# EAGLE design RedBoard-Artemis-Nano (EAGLE 9.4.2)

## Sheet 1 of 2
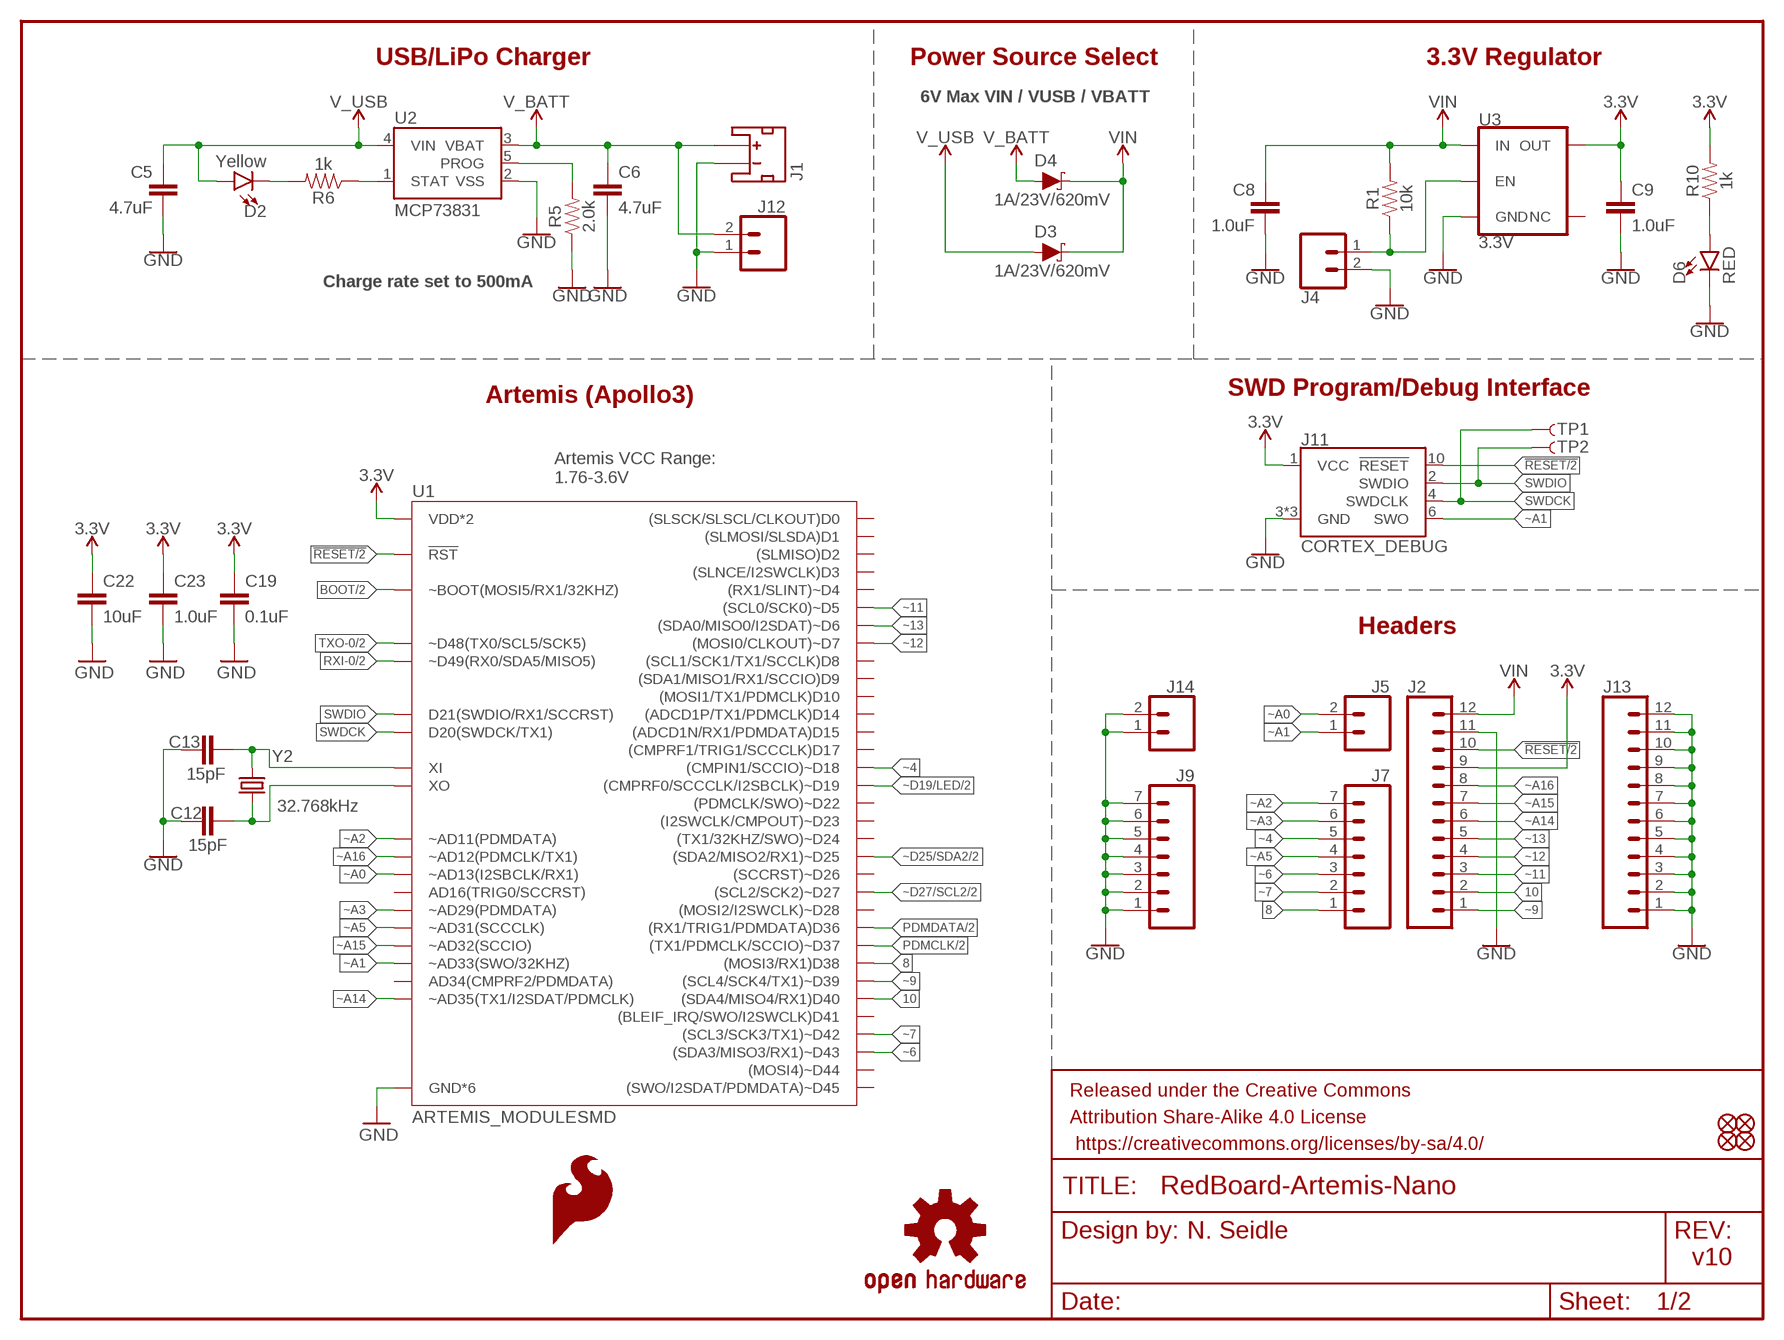
[diagram p0: schematic, sheet 1]

### Parts
C5  4.7uF  4.7UF-0603-6.3V-(10%)  [0603]
C6  4.7uF  4.7UF-0603-6.3V-(10%)  [0603]
C8  1.0uF  1.0UF-0402T-16V-10%  [0402-TIGHT]
C9  1.0uF  1.0UF-0402T-16V-10%  [0402-TIGHT]
C12  15pF  15PF-0603-50V-5%  [0603]
C13  15pF  15PF-0603-50V-5%  [0603]
C19  0.1uF  0.1UF-0402T-16V-10%  [0402-TIGHT]
C22  10uF  10UF-0603-6.3V-20%  [0603]
C23  1.0uF  1.0UF-0402T-16V-10%  [0402-TIGHT]
D2  Yellow  LED-YELLOW0603  [LED-0603]
D3  1A/23V/620mV  DIODE-SCHOTTKY-BAT20J  [SOD-323]
D4  1A/23V/620mV  DIODE-SCHOTTKY-BAT20J  [SOD-323]
D6  RED  LED-RED0603  [LED-0603]
FD1  FIDUCIALUFIDUCIAL  [FIDUCIAL-MICRO]
FD2  FIDUCIALUFIDUCIAL  [FIDUCIAL-MICRO]
FD3  FIDUCIALUFIDUCIAL  [FIDUCIAL-MICRO]
FD4  FIDUCIALUFIDUCIAL  [FIDUCIAL-MICRO]
FRAME1  FRAME-LETTER  [CREATIVE_COMMONS]
J1  JST_2MM_MALE  [JST-2-SMD]
J2  CONN_12NO_SILK  [1X12_NO_SILK]
J4  CONN_021X02_NO_SILK  [1X02_NO_SILK]
J5  CONN_021X02_NO_SILK  [1X02_NO_SILK]
J7  CONN_07NO_SILK  [1X07_NO_SILK]
J9  CONN_07NO_SILK  [1X07_NO_SILK]
J11  CORTEX_DEBUG  CORTEX_JTAG_DEBUG_MINIMUM_PTH_NS  [2X5-PTH-1.27MM-NO_SILK]
J12  CONN_021X02_NO_SILK  [1X02_NO_SILK]
J13  CONN_12NO_SILK  [1X12_NO_SILK]
J14  CONN_021X02_NO_SILK  [1X02_NO_SILK]
LOGO1  SFE_LOGO_FLAME.1_INCH  [SFE_LOGO_FLAME_.1]
LOGO2  OSHW-LOGONO_SILK  [DUMMY]
LOGO4  SFE_LOGO_FLAME.1_INCH  [SFE_LOGO_FLAME_.1]
R1  10k  10KOHM-0603-1/10W-1%  [0603]
R5  2.0k  2.0KOHM-0603-1/10W-5%  [0603]
R6  1k  1KOHM-0603-1/10W-1%  [0603]
R10  1k  1KOHM-0603-1/10W-1%  [0603]
TP1  TEST-POINT3X5  [PAD.03X.05]
TP2  TEST-POINT3X5  [PAD.03X.05]
U1  ARTEMIS_MODULESMD  [ARTEMIS_FP]
U2  MCP73831  [SOT23-5]
U3  3.3V  V_REG_AP2112K-3.3V  [SOT23-5]
Y2  32.768kHz  CRYSTAL-32.768KHZSMD-3.2X1.5  [CRYSTAL-SMD-3.2X1.5MM]

### Nets
3.3V: C9.1 C19.2 C22.1 C23.1 J2.9 J11.1(VCC) R10.2 U1.VDD@36(VDD*2) U1.VDD@37(VDD*2) U3.5(OUT) ; also sheet 2
8: J7.1 U1.D38((MOSI3/RX1)D38)
10: J2.2 U1.D40((SDA4/MISO4/RX1)D40)
!RESET: J2.10 J11.10(!RESET) U1.~RST(!RST) ; also sheet 2
BOOT: U1.BOOT(~BOOT(MOSI5/RX1/32KHZ)) ; also sheet 2
GND: C5.2 C6.2 C8.2 C9.2 C12.1 C13.1 C19.1 C22.2 C23.2 D6.C J1.1(-) J2.11 J4.2 J9.1 J9.2 J9.3 J9.4 J9.5 J9.6 J9.7 J11.3(GND) J11.5(GND) J11.9(GND) J12.1 J13.1 J13.2 J13.3 J13.4 J13.5 J13.6 J13.7 J13.8 J13.9 J13.10 J13.11 J13.12 J14.1 J14.2 R5.1 U1.GND@1(GND*6) U1.GND@22(GND*6) U1.GND@38(GND*6) U1.GND@39(GND*6) U1.GND@47(GND*6) U1.GND@59(GND*6) U2.2(VSS) U3.2(GND) ; also sheet 2
N$1: R5.2 U2.5(PROG)
N$2: C12.2 U1.XO Y2.P$2
N$3: D2.C R6.2
N$4: R6.1 U2.1(STAT)
N$8: C13.2 U1.XI Y2.P$1
N$10: D6.A R10.1
PDMCLK: U1.~D37((TX1/PDMCLK/SCCIO)~D37) ; also sheet 2
PDMDATA: U1.D36((RX1/TRIG1/PDMDATA)D36) ; also sheet 2
RXI-0: U1.RXI-0(~D49(RX0/SDA5/MISO5)) ; also sheet 2
SWDCK: J11.4(SWDCLK) TP1.P$1 U1.SWDCK(D20(SWDCK/TX1))
SWDIO: J11.2(SWDIO) TP2.P$1 U1.SWDIO(D21(SWDIO/RX1/SCCRST))
TXO-0: U1.TXO-0(~D48(TX0/SCL5/SCK5)) ; also sheet 2
V_BATT [power]: C6.1 D4.A J1.2(+) J12.2 U2.3(VBAT)
V_USB: C5.1 D2.A D3.A U2.4(VIN) ; also sheet 2
VIN: C8.1 D3.C D4.C J2.12 R1.2 U3.1(IN)
VREG_EN: J4.1 R1.1 U3.3(EN)
~4: J7.5 U1.~D18((CMPIN1/SCCIO)~D18)
~6: J7.3 U1.~D43((SDA3/MISO3/RX1)~D43)
~7: J7.2 U1.~D42((SCL3/SCK3/TX1)~D42)
~9: J2.1 U1.~D39((SCL4/SCK4/TX1)~D39)
~11: J2.3 U1.~D5((SCL0/SCK0)~D5)
~12: J2.4 U1.D7((MOSI0/CLKOUT)~D7)
~13: J2.5 U1.~D6((SDA0/MISO0/I2SDAT)~D6)
~A0: J5.2 U1.~AD13(~AD13(I2SBCLK/RX1))
~A1: J5.1 J11.6(SWO) U1.~AD33/SWO(~AD33(SWO/32KHZ))
~A2: J7.7 U1.~AD11(~AD11(PDMDATA))
~A3: J7.6 U1.~AD29(~AD29(PDMDATA))
~A5: J7.4 U1.~AD31(~AD31(SCCCLK))
~A14: J2.6 U1.~AD35(~AD35(TX1/I2SDAT/PDMCLK))
~A15: J2.7 U1.~AD32(~AD32(SCCIO))
~A16: J2.8 U1.~AD12(~AD12(PDMCLK/TX1))
~D19/LED: U1.~D19((CMPRF0/SCCCLK/I2SBCLK)~D19) ; also sheet 2
~D25/SDA2: U1.~D25((SDA2/MISO2/RX1)~D25) ; also sheet 2
~D27/SCL2: U1.~D27((SCL2/SCK2)~D27) ; also sheet 2
Unconnected: J1.NC1(PAD1) J1.NC2(PAD2) U1.AD16(AD16(TRIG0/SCCRST)) U1.AD34(AD34(CMPRF2/PDMDATA)) U1.D0((SLSCK/SLSCL/CLKOUT)D0) U1.D1((SLMOSI/SLSDA)D1) U1.D2((SLMISO)D2) U1.D3((SLNCE/I2SWCLK)D3) U1.D8((SCL1/SCK1/TX1/SCCLK)D8) U1.D9((SDA1/MISO1/RX1/SCCIO)D9) U1.D10((MOSI1/TX1/PDMCLK)D10) U1.D14((ADCD1P/TX1/PDMCLK)D14) U1.D15((ADCD1N/RX1/PDMDATA)D15) U1.D17((CMPRF1/TRIG1/SCCCLK)D17) U1.D41((BLEIF_IRQ/SWO/I2SWCLK)D41) U1.~D4((RX1/SLINT)~D4) U1.~D22((PDMCLK/SWO)~D22) U1.~D23((I2SWCLK/CMPOUT)~D23) U1.~D24((TX1/32KHZ/SWO)~D24) U1.~D26((SCCRST)~D26) U1.~D28((MOSI2/I2SWCLK)~D28) U1.~D44((MOSI4)~D44) U1.~D45((SWO/I2SDAT/PDMDATA)~D45) U3.4(NC)

### Notes on the sheet
- USB/LiPo Charger | Power Source Select | 3.3V Regulator
- 6V Max VIN / VUSB / VBATT
- Charge rate set to 500mA
- Artemis (Apollo3) | SWD Program/Debug Interface
- Artemis VCC Range:
  1.76-3.6V
- Headers
- N. Seidle
- v10

## Sheet 2 of 2
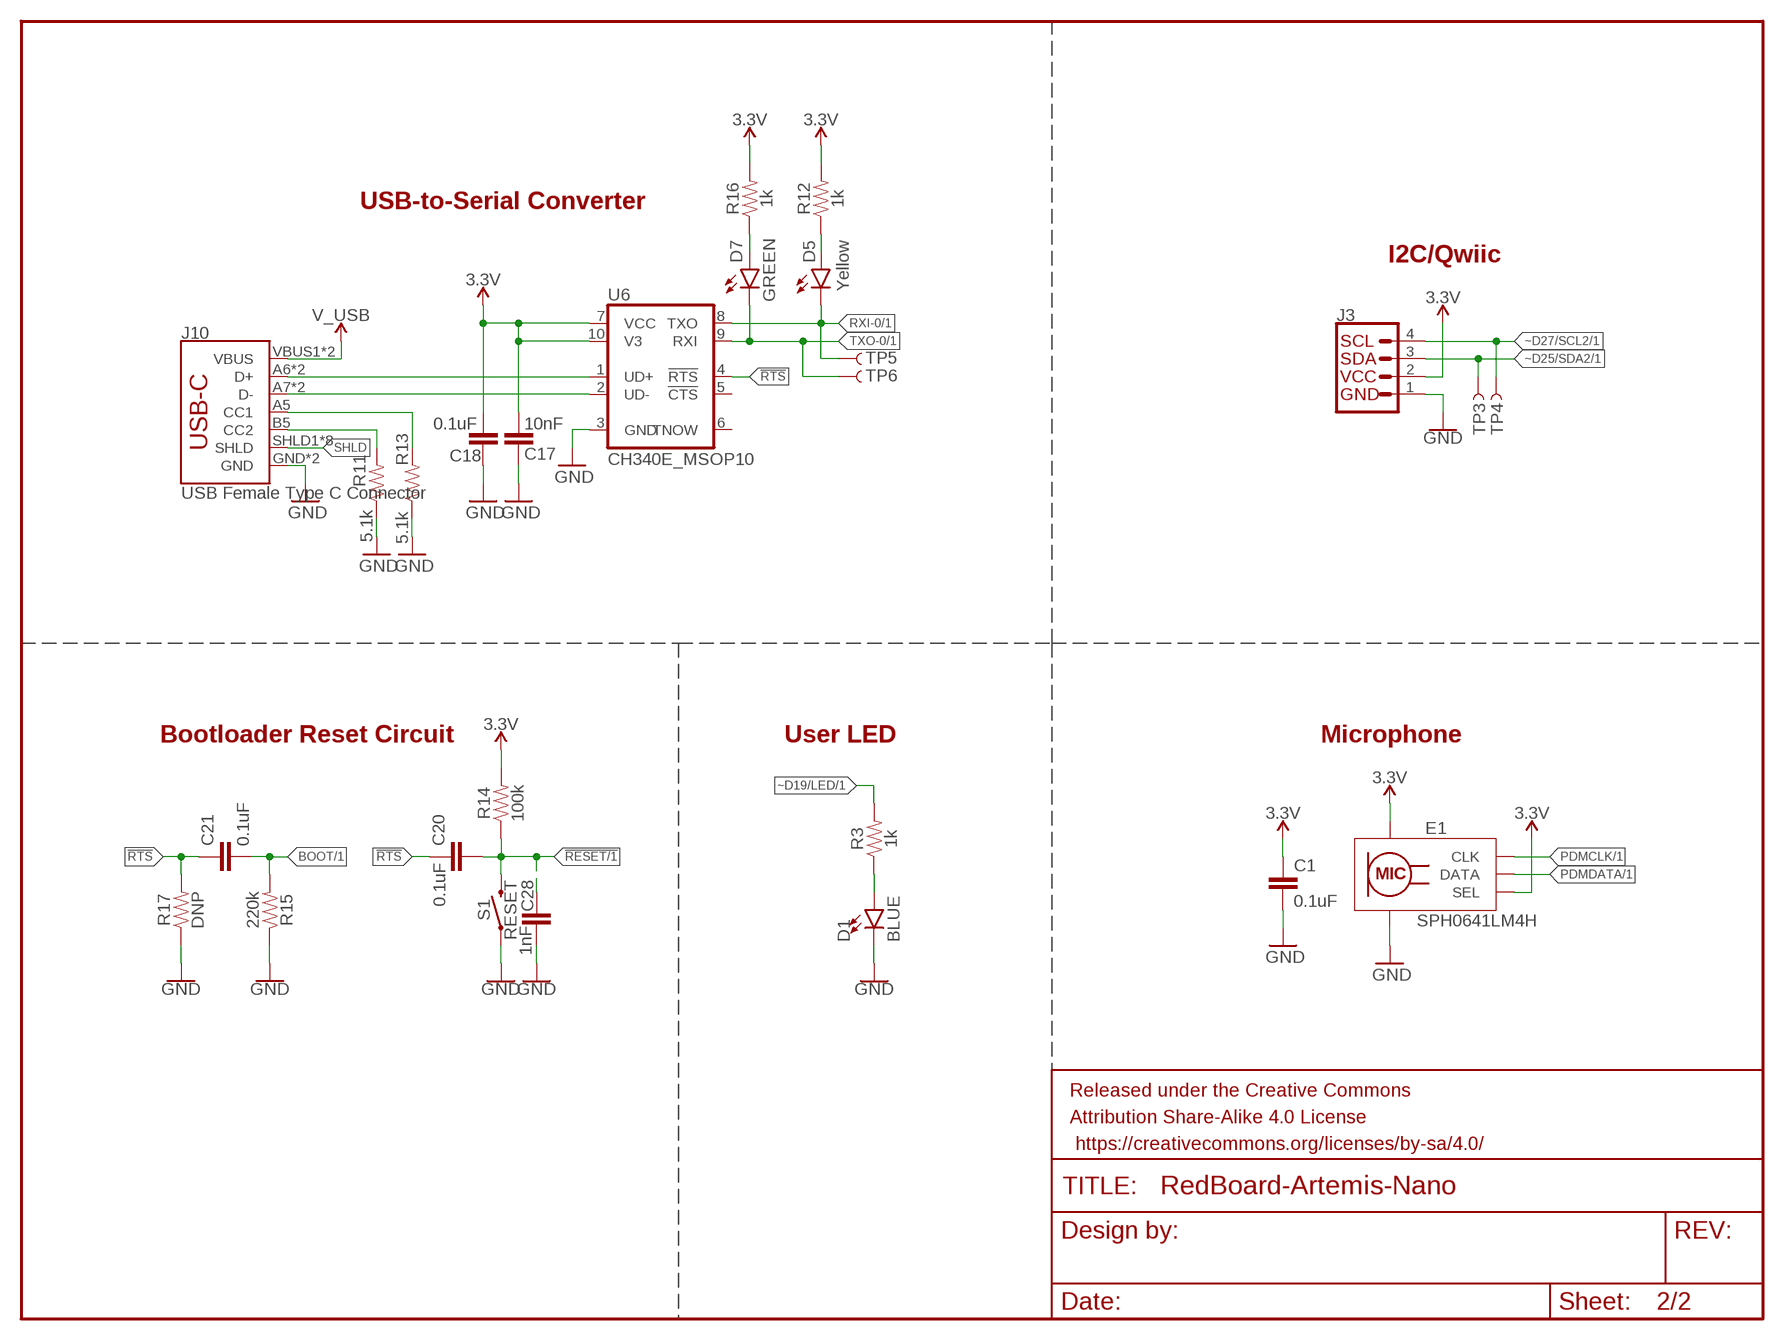
[diagram p1: schematic, sheet 2]

### Parts
C1  0.1uF  0.1UF-0402T-16V-10%  [0402-TIGHT]
C17  10nF  10NF-0603-50V-10%  [0603]
C18  0.1uF  0.1UF-0603-25V-(+80/-20%)  [0603]
C20  0.1uF  0.1UF-0603-25V-5%  [0603]
C21  0.1uF  0.1UF-0603-25V-5%  [0603]
C28  1nF  1.0NF/1000PF-0603-50V-10%  [0603]
D1  BLUE  LED-BLUE0603  [LED-0603]
D5  Yellow  LED-YELLOW0603  [LED-0603]
D7  GREEN  LED-GREEN0603  [LED-0603]
E1  SPH0641LM4H  SPH0641LM4H-1_MICROPHONE  [SPH0641LM4H-1_MICROPHONE]
FRAME2  FRAME-LETTERNO_PACKAGE  [DUMMY]
J3  QWIIC_CONNECTORJS-1MM  [JST04_1MM_RA]
J10  USB Female Type C Connector  USB_C4-LAYER-ISOLATED  [USB-C-16P-4LAYER-ISOLATED]
R3  1k  1KOHM-0603-1/10W-1%  [0603]
R11  5.1k  5.1KOHM5.1KOHM-0603-1/10W-1%  [0603]
R12  1k  1KOHM-0603-1/10W-1%  [0603]
R13  5.1k  5.1KOHM5.1KOHM-0603-1/10W-1%  [0603]
R14  100k  100KOHM-0603-1/10W-1%  [0603]
R15  220k  220KOHM-0603-1/10W-1%  [0603]
R16  1k  1KOHM-0603-1/10W-1%  [0603]
R17  DNP  RESISTOR0603  [0603]
S1  RESET  MOMENTARY-SWITCH-SPST-SMD-4.6X2.8MM  [TACTILE_SWITCH_SMD_4.6X2.8MM]
TP3  TEST-POINT3X5  [PAD.03X.05]
TP4  TEST-POINT3X5  [PAD.03X.05]
TP5  TEST-POINT3X5  [PAD.03X.05]
TP6  TEST-POINT3X5  [PAD.03X.05]
U6  CH340E_MSOP10  [MSOP10]

### Nets
3.3V: C1.1 C17.1 C18.1 E1.2(SEL) E1.5(VDD) J3.2 R12.2 R14.2 R16.2 U6.7(VCC) U6.10(V3) ; also sheet 1
!RESET: C20.2 C28.1 R14.1 S1.3 S1.4 ; also sheet 1
!RTS: C20.1 C21.1 R17.2 U6.4(!RTS)
BOOT: C21.2 R15.2 ; also sheet 1
CC1: J10.A5(CC1) R13.2
CC2: J10.B5(CC2) R11.2
D+1: J10.A6(D+) J10.B6(D+) U6.1(UD+)
D-1: J10.A7(D-) J10.B7(D-) U6.2(UD-)
GND: C1.2 C17.2 C18.2 C28.2 D1.C E1.3(GND) E1.6(GND) E1.7(GND) E1.8(GND) J3.1 J10.GND J10.GND2(GND) R11.1 R13.1 R15.1 R17.1 S1.1 S1.2 U6.3(GND) ; also sheet 1
N$5: D7.A R16.1
N$7: D1.A R3.1
N$9: D5.A R12.1
PDMCLK: E1.4(CLK) ; also sheet 1
PDMDATA: E1.1(DATA) ; also sheet 1
RXI-0: D5.C TP5.P$1 U6.8(TXO) ; also sheet 1
SHLD: J10.SHLD1(SHLD) J10.SHLD2(SHLD) J10.SHLD3(SHLD) J10.SHLD4(SHLD) J10.SHLD5(SHLD) J10.SHLD6(SHLD) J10.SHLD7(SHLD) J10.SHLD8(SHLD)
TXO-0: D7.C TP6.P$1 U6.9(RXI) ; also sheet 1
V_USB: J10.VBUS1(VBUS) J10.VBUS2(VBUS) ; also sheet 1
~D19/LED: R3.2 ; also sheet 1
~D25/SDA2: J3.3 TP3.P$1 ; also sheet 1
~D27/SCL2: J3.4 TP4.P$1 ; also sheet 1
Unconnected: U6.5(!CTS) U6.6(TNOW)

### Notes on the sheet
- USB-to-Serial Converter
- I2C/Qwiic
- Bootloader Reset Circuit | User LED | Microphone

## Library data of the parts
C1 C19 = SparkFun-Capacitors:0.1UF: 0.1µF ceramic capacitors A capacitor is a passive two-terminal electrical component used to store electrical energy temporarily in an electric field.; PROD_ID: CAP-12416
C5 C6 = SparkFun-Capacitors:4.7UF: 4.7µF ceramic capacitors A capacitor is a passive two-terminal electrical component used to store electrical energy temporarily in an electric field.; PROD_ID: CAP-08280
C8 C9 C23 = SparkFun-Capacitors:1.0UF: 1µF ceramic capacitors A capacitor is a passive two-terminal electrical component used to store electrical energy temporarily in an electric field.; PROD_ID: CAP-12417
C12 C13 = SparkFun-Capacitors:15PF: 15pF ceramic capacitors A capacitor is a passive two-terminal electrical component used to store electrical energy temporarily in an electric field.; PROD_ID: CAP-07881
C17 = SparkFun-Capacitors:10NF: 0.01uF/10nF/10,000pF ceramic capacitors A capacitor is a passive two-terminal electrical component used to store electrical energy temporarily in an electric field. CAP-09321; PROD_ID: CAP-00867
C18 = SparkFun-Capacitors:0.1UF: 0.1µF ceramic capacitors A capacitor is a passive two-terminal electrical component used to store electrical energy temporarily in an electric field.; PROD_ID: CAP-00810
C20 C21 = SparkFun-Capacitors:0.1UF: 0.1µF ceramic capacitors A capacitor is a passive two-terminal electrical component used to store electrical energy temporarily in an electric field.; PROD_ID: CAP-08604
C22 = SparkFun-Capacitors:10UF: 10.0µF ceramic capacitors A capacitor is a passive two-terminal electrical component used to store electrical energy temporarily in an electric field.; PROD_ID: CAP-11015
C28 = SparkFun-Capacitors:1.0NF/1000PF: 1nF/1,000pF ceramic capacitors A capacitor is a passive two-terminal electrical component used to store electrical energy temporarily in an electric field.; PROD_ID: CAP-07886
D1 = SparkFun-LED:LED-BLUE: Blue SMD LED Used in manufacturing of various products at SparkFun Packages: 0603 - SMD 0603 package [Product Link] <http://www.digikey.com/product-detail/en/SMLE12BC7TT86/511-1589-2-ND/1641808> 1206 - SMD1206 package [Product Link] <http://www.digikey.com/product-detail/en/lite-on-inc/LTST-C150TBKT/160-1643-1-ND/573584> SparkFun Products: ESP8266 Thing-Dev Board <https://www.sparkfun.com/products/13711> RedBoard <https://www.sparkfun.com/products/12757>; PROD_ID: DIO-08575
D2 D5 = SparkFun-LED:LED-YELLOW: Yellow SMD LED Used in manufacturing several products at SparkFun. Packages: 0603 - SMD 0603 package[Product Link] <http://www.kingbrightusa.com/product.asp?catalog_name=LED&product_id=APT1608SYCK> 0603 -SMART - SMART SMD 0603 package (more efficient/more expensive) [Product Link] <http://www.osram-os.com/osram_os/en/products/product-catalog/led-light-emitting-diodes/smartled-0603/ly-l29k/index.jsp> LilyPad - SMD1206 package[Product Datasheet] <https://www.sparkfun.com/datasheets/DevTools/LilyPad/Q150YUS4.pdf> SparkFun Products: Blynk Board <https://www.sparkfun.com/products/13794> IOIO-OTG <https://www.sparkfun.com/products/13613> XBee Explorer Serial <https://www.sparkfun.com/products/13225>; PROD_ID: DIO-09003
D3 D4 = SparkFun-DiscreteSemi:DIODE-SCHOTTKY: Schottky diode A Schottky diode is a semiconductor diode which has a low forward voltage drop and a very fast switching action.; PROD_ID: DIO-11623
D6 = SparkFun-LED:LED-RED: Red SMD LED Used in manufacturing of most products at SparkFun Packages: 0603 - SMD 0603 package [Product Link] <http://docs.avagotech.com/docs/AV02-0551EN> 0603 SMART - SMD 0603 SMART package ( more efficient and expensive)[Product Link] <http://www.osram-os.com/Graphics/XPic2/00077099_0.pdf> 1206 - SMD1206 package [Product Link] <https://www.sparkfun.com/datasheets/DevTools/LilyPad/Q150OVS4.pdff> SparkFun Products: Pro Mini 328 -5V <https://www.sparkfun.com/products/821> RedBoard <https://www.sparkfun.com/products/12757> IOIO-OTG <https://www.sparkfun.com/products/13613>; PROD_ID: DIO-00819
D7 = SparkFun-LED:LED-GREEN: Green SMD LED Used in manufacturing of various products at SparkFun Packages: 0603 - SMD 0603 package [Product Link] <http://www.futureelectronics.com/en/technologies/semiconductors/optoelectronics/leds/Pages/9894312-LTST-C190GKT.aspx?CrossPart=HSMG-C190&IM=0> LilyPad 1206 - SMD1206 LilyPad package [Product Link] <http://www.futureelectronics.com/en/Technologies/Product.aspx?ProductID=IN150NGHARVATEKCORPORATION2049943&IM=0> 1206 - SMD1206 package [Product Link] <http://www.futureelectronics.com/en/technologies/semiconductors/optoelectronics/leds/Pages/8315665-LTST-C150KGKT.aspx?IM=0> 1206 Bottom Mount -SMD 1206 Bottom Mount [Product Link] <http://www.digikey.com/product-detail/en/lite-on-inc/LTST-C230KGKT/160-1456-1-ND/386854> SparkFun Products: Pro Mini 328 -5V <https://www.sparkfun.com/products/821> RedBoard <https://www.sparkfun.com/products/12757> MP3 Trigger <https://www.sparkfun.com/products/13720> Makey Makey <https://www.sparkfun.com/products/11076>; PROD_ID: DIO-00821
E1 = SparkFun-Sensors:SPH0641LM4H-1_MICROPHONE: SPH0641LM4H-1 Microphone A miniature, high-performance, low power, bottom port silicon digital microphone with a single bit PDM output.; PROD_ID: IC-14361; VALUE: SPH0641LM4H-1
FD1-FD4 = SparkFun-Aesthetics:FIDUCIAL: Fiducial Alignment Points Point-of-reference for pick-and-place machines and other optical instruments.
FRAME1 = SparkFun-Aesthetics:FRAME-LETTER: Schematic Frame - Letter Standard 8.5x11 US Letter frame
FRAME2 = SparkFun-Aesthetics:FRAME-LETTER: Schematic Frame - Letter Standard 8.5x11 US Letter frame; DESIGNER: Nobody; VERSION: v01
J1 = SparkFun-Connectors:JST_2MM_MALE: JST 2MM MALE RA CONNECTOR Two pin, compact surface mount connector. Commonly used as a battery input connection point. We really like the solid locking feeling and high current rating on these small connectors. We use these all the time as battery connectors. Mates to single-cell LiPo batteries. Here is the connector we sell at SparkFun: JST Right Angle Connector - White <https://www.sparkfun.com/products/8612> (PRT-08612) Datasheet <http://www.sparkfun.com/datasheets/Prototyping/Connectors/JST-Horizontal.pdf> It was used on these SparkFun products: SparkFun MOSFET Power Controller <https://www.sparkfun.com/products/11214> (PRT-11214) SparkFun Battery Babysitter - LiPo Battery Manager <https://www.sparkfun.com/products/13777> (PRT-13777) And many, many others that required a lipo battery connection.; PROD_ID: CONN-11443; SF_ID: PRT-08612
J2 J13 = SparkFun-Connectors:CONN_12: Multi connection point. Often used as Generic Header-pin footprint for 0.1 inch spaced/style header connections On any of the 0.1 inch spaced packages, you can populate with these: Break Away Headers - Straight <https://www.sparkfun.com/products/116> (PRT-00116) Break Away Male Headers - Right Angle <https://www.sparkfun.com/products/553> (PRT-00553) Female Headers <https://www.sparkfun.com/products/115> (PRT-00115) Break Away Headers - Machine Pin <https://www.sparkfun.com/products/117> (PRT-00117) Break Away Female Headers - Swiss Machine Pin <https://www.sparkfun.com/products/743> (PRT-00743) For SCREWTERMINALS and SPRING TERMINALS visit here: Screw Terimnals on SparkFun.com <https://www.sparkfun.com/search/results?term=Screw+Terminals> (5mm/3.5mm/2.54mm spacing) This device is also useful as a general connection point to wire up your design to another part of your project. Our various solder wires solder well into these plated through hole pads. Hook-Up Wire - Assortment (Stranded, 22 AWG) <https://www.sparkfun.com/products/11375> (PRT-11375) Hook-Up Wire - Assortment (Solid Core, 22 AWG) <https://www.sparkfun.com/products/11367> (PRT-11367) View the entire wire category on our website here <https://www.sparkfun.com/categories/141> Special notes: Molex polarized connector foot print use with SKU : PRT-08231 with associated crimp pins and housings. 1MM SMD Version SKU: PRT-10208 NOTES ON THE VARIANTS LOCK and LOCK_LONGPADS... This footprint was designed to help hold the alignment of a through-hole component (i.e. 6-pin header) while soldering it into place. You may notice that each hole has been shifted either up or down by 0.005 of an inch from it's more standard position (which is a perfectly straight line). This slight alteration caused the pins (the squares in the middle) to touch the edges of the holes. Because they are alternating, it causes a "brace" to hold the component in place. 0.005 has proven to be the perfect amount of "off-center" position when using our standard breakaway headers. Although looks a little odd when you look at the bare footprint, once you have a header in there, the alteration is very hard to notice. Also,if you push a header all the way into place, it is covered up entirely on the bottom side.
J3 = SparkFun-Connectors:QWIIC_CONNECTOR: SparkFun I2C Standard Qwiic Connector An SMD 1mm pitch JST connector makes it easy and quick (get it? Qwiic?) to connect I2C devices to each other. The Qwiic system <http://www.sparkfun.com/qwiic> enables fast and solderless connection between popular platforms and various sensors and actuators. We carry 200mm <https://www.sparkfun.com/products/14204>, 100mm <https://www.sparkfun.com/products/14205>, 50mm <https://www.sparkfun.com/products/14206>, and breadboard friendly <https://www.sparkfun.com/products/14207> Qwiic cables. We also offer 10 pcs strips <https://www.sparkfun.com/products/14323> the SMD connectors.; PROD_ID: CONN-13694
J4 J5 J12 J14 = SparkFun-Connectors:CONN_02: Multi connection point. Often used as Generic Header-pin footprint for 0.1 inch spaced/style header connections On any of the 0.1 inch spaced packages, you can populate with these: Break Away Headers - Straight <https://www.sparkfun.com/products/116> (PRT-00116) Break Away Male Headers - Right Angle <https://www.sparkfun.com/products/553> (PRT-00553) Female Headers <https://www.sparkfun.com/products/115> (PRT-00115) Break Away Headers - Machine Pin <https://www.sparkfun.com/products/117> (PRT-00117) Break Away Female Headers - Swiss Machine Pin <https://www.sparkfun.com/products/743> (PRT-00743) For SCREWTERMINALS and SPRING TERMINALS visit here: Screw Terimnals on SparkFun.com <https://www.sparkfun.com/search/results?term=Screw+Terminals> (5mm/3.5mm/2.54mm spacing) This device is also useful as a general connection point to wire up your design to another part of your project. Our various solder wires solder well into these plated through hole pads. Hook-Up Wire - Assortment (Stranded, 22 AWG) <https://www.sparkfun.com/products/11375> (PRT-11375) Hook-Up Wire - Assortment (Solid Core, 22 AWG) <https://www.sparkfun.com/products/11367> (PRT-11367) View the entire wire category on our website here <https://www.sparkfun.com/categories/141> Special notes: Molex polarized connector foot print use with: PRT-08233 with associated crimp pins and housings. 2.54_SCREWTERM for use with PRT-10571. 3.5mm Screw Terminal footprints for PRT-08084 5mm Screw Terminal footprints for use with PRT-08432
J7 J9 = SparkFun-Connectors:CONN_07: Multi connection point. Often used as Generic Header-pin footprint for 0.1 inch spaced/style header connections On any of the 0.1 inch spaced packages, you can populate with these: Break Away Headers - Straight <https://www.sparkfun.com/products/116> (PRT-00116) Break Away Male Headers - Right Angle <https://www.sparkfun.com/products/553> (PRT-00553) Female Headers <https://www.sparkfun.com/products/115> (PRT-00115) Break Away Headers - Machine Pin <https://www.sparkfun.com/products/117> (PRT-00117) Break Away Female Headers - Swiss Machine Pin <https://www.sparkfun.com/products/743> (PRT-00743) For SCREWTERMINALS and SPRING TERMINALS visit here: Screw Terimnals on SparkFun.com <https://www.sparkfun.com/search/results?term=Screw+Terminals> (5mm/3.5mm/2.54mm spacing) This device is also useful as a general connection point to wire up your design to another part of your project. Our various solder wires solder well into these plated through hole pads. Hook-Up Wire - Assortment (Stranded, 22 AWG) <https://www.sparkfun.com/products/11375> (PRT-11375) Hook-Up Wire - Assortment (Solid Core, 22 AWG) <https://www.sparkfun.com/products/11367> (PRT-11367) View the entire wire category on our website here <https://www.sparkfun.com/categories/141> Special notes: Molex polarized connector foot print use with SKU : PRT-08231 with associated crimp pins and housings. 1MM SMD Version SKU: PRT-10208 NOTES ON THE VARIANTS LOCK and LOCK_LONGPADS... This footprint was designed to help hold the alignment of a through-hole component (i.e. 6-pin header) while soldering it into place. You may notice that each hole has been shifted either up or down by 0.005 of an inch from it's more standard position (which is a perfectly straight line). This slight alteration caused the pins (the squares in the middle) to touch the edges of the holes. Because they are alternating, it causes a "brace" to hold the component in place. 0.005 has proven to be the perfect amount of "off-center" position when using our standard breakaway headers. Although looks a little odd when you look at the bare footprint, once you have a header in there, the alteration is very hard to notice. Also,if you push a header all the way into place, it is covered up entirely on the bottom side.
J10 = SparkFun-Connectors:USB_C: USB Type C 16Pin Connector Super Speed pins not available on the 16-pin purely SMD connector so this part is best for USB 2.0 implementations. D1 and D2 are tied together enabling D+/- no matter which way the cable is plugged into the connector. The two channel configuration pins (CC1/2) are exposed. These are normally connected to ground via 5.1k resistors but can be reconfigured for high current/high power applications.; PROD_ID: CONN-14122
J11 = SparkFun-Connectors:CORTEX_JTAG_DEBUG_MINIMUM: Cortex Debug Connector - 10 pin Supports JTAG debug, Serial Wire debug, and Serial Wire Viewer. PTH and SMD connector options available. General Connector Information <http://infocenter.arm.com/help/topic/com.arm.doc.faqs/attached/13634/cortex_debug_connectors.pdf> Products: PTH Connector <http://www.digikey.com/product-detail/en/cnc-tech/3220-10-0100-00/1175-1627-ND/3883661> -via Digi-Key SparkFun PSoc <https://www.sparkfun.com/products/13229> SparkFun T <https://www.sparkfun.com/products/13810>
LOGO1 LOGO4 = SparkFun-Aesthetics:SFE_LOGO_FLAME: SparkFun Flame Logo This is the SparkFun flame logo. The logo on the schematic will always be the same size; the package variant is the height of the flame. Default layer for the logo on the board is tSilk.
LOGO2 = SparkFun-Aesthetics:OSHW-LOGO: Open-Source Hardware (OSHW) Logo This logo indicates the piece of hardware it is found on incorporates a OSHW license and/or adheres to the definition of open source hardware found here: http://freedomdefined.org/OSHW
R1 = SparkFun-Resistors:10KOHM: 10kΩ resistor A resistor is a passive two-terminal electrical component that implements electrical resistance as a circuit element. Resistors act to reduce current flow, and, at the same time, act to lower voltage levels within circuits. - Wikipedia; PROD_ID: RES-00824
R3 R6 R10 R12 R16 = SparkFun-Resistors:1KOHM: 1kΩ resistor A resistor is a passive two-terminal electrical component that implements electrical resistance as a circuit element. Resistors act to reduce current flow, and, at the same time, act to lower voltage levels within circuits. - Wikipedia; PROD_ID: RES-07856
R5 = SparkFun-Resistors:2.0KOHM: 2kΩ resistor A resistor is a passive two-terminal electrical component that implements electrical resistance as a circuit element. Resistors act to reduce current flow, and, at the same time, act to lower voltage levels within circuits. - Wikipedia; PROD_ID: RES-08296
R11 R13 = SparkFun-Resistors:5.1KOHM; PROD_ID: RES-12083
R14 = SparkFun-Resistors:100KOHM: 100kΩ resistor A resistor is a passive two-terminal electrical component that implements electrical resistance as a circuit element. Resistors act to reduce current flow, and, at the same time, act to lower voltage levels within circuits. - Wikipedia; PROD_ID: RES-07828
R15 = SparkFun-Resistors:220KOHM: 220kΩ resistor A resistor is a passive two-terminal electrical component that implements electrical resistance as a circuit element. Resistors act to reduce current flow, and, at the same time, act to lower voltage levels within circuits. - Wikipedia; PROD_ID: RES-08969
R17 = SparkFun-Resistors:RESISTOR: Generic Resistor Package
S1 = SparkFun-Switches:MOMENTARY-SWITCH-SPST: Momentary Switch (Pushbutton) - SPST Normally-open (NO) SPST momentary switches (buttons, pushbuttons). Variants PTH-12MM - 12mm square, through-hole Momentary Pushbutton Switch - 12mm Square <https://www.sparkfun.com/products/9190> (COM-09190) PTH-6.0MM, PTH-6.0MM-KIT - 6.0mm square, through-hole Mini Pushbutton Switch <https://www.sparkfun.com/products/97> (COM-00097) KIT package intended for soldering kit's - only one side of pads' copper is exposed. PTH-RIGHT-ANGLE-KIT - Right-angle, through-hole Right Angle Tactile Button <https://www.sparkfun.com/products/10791> - Used on SparkFun BigTime Watch Kit <https://www.sparkfun.com/products/11734> SMD-12MM - 12mm square, surface-mount Tactile Button - SMD (12mm) <https://www.sparkfun.com/products/12993> (COM-12993) Used on SparkFun PicoBoard <https://www.sparkfun.com/products/11888> SMD-4.5MM - 4.5mm Square Trackball Switch Used on SparkFun Blackberry Trackballer Breakout <https://www.sparkfun.com/products/13169> SMD-4.6MMX2.8MM - 4.60mm x 2.80mm, surface mount Used on SparkFun SAMD21 Mini Breakout <https://www.sparkfun.com/products/13664> SMD-5.2MM, SMD-5.2-REDUNDANT - 5.2mm square, surface-mount Mini Pushbutton Switch - SMD <https://www.sparkfun.com/products/8720> (COM-08720) Used on Arduino Pro Mini <https://www.sparkfun.com/products/11114> REDUNDANT package connects both switch circuits together SMD-6.0X3.5MM - 6.0 x 3.5mm, surface mount Momentary Reset Switch SMD <https://www.sparkfun.com/products/8229> (COM-08229) SMD-6.2MM-TALL - 6.2mm square, surface mount Tactile Button - SMD (6mm) <https://www.sparkfun.com/products/12992> Used on SparkFun Digital Sandbox <https://www.sparkfun.com/products/12651> SMD-RIGHT-ANGLE - Right-angle, surface mount Used on SparkFun Block for Intel® Edison - Arduino <https://www.sparkfun.com/products/13036>; PROD_ID: SWCH-13065
TP1-TP6 = SparkFun-Connectors:TEST-POINT: SparkFun Test Points Bare copper test points for troubleshooting or In-Circuit-Testing. These are used by our Production team for verifying production board runs using pogo-pins on test beds. SparkFun Products: SparkFun LSM9DS1 Breakout <https://www.sparkfun.com/products/13284> SparkFun PSOC <https://www.sparkfun.com/products/13714> SparkFun Load Cell Amplifier <https://www.sparkfun.com/products/13879>
U1 = SparkFun-IC-Microcontroller:ARTEMIS_MODULE: Description: The Artemis Module from SparkFun is a Cortex-M4F with BLE 5.0 running up to 96MHz and with as low power as 6uA per MHz (less than 5mW). This is the world's first module to bridge the market between hobbyists and consumer products. We've packaged all the power of a modern microcontroller into a module that is both extremely easy to use but is mass-market ready. The flexibility of the Artemis module starts with our [Arduino core](https://github.com/sparkfun/Arduino_Apollo3). You can program and use the Artemis module just like you would an Uno or any other Arduino. Time to first blink is just 5 minutes away! We built the core from the ground up, making it fast and as light weight as possible.; PROD_ID: SUB-14415
U2 = SparkFun-IC-Power:MCP73831: MCP73831T Li-Ion, Li-Pol Controller Miniature single cell, fully integrated Li-Ion, Li-polymer charge management controller Datasheet <http://ww1.microchip.com/downloads/en/DeviceDoc/20001984g.pdf> SparkFun Products: SparkFun ESP32 Thing <https://www.sparkfun.com/products/13907> SparkFun 9DoF Razor IMU M0 <https://www.sparkfun.com/products/14001>; PROD_ID: IC-09995
U3 = SparkFun-IC-Power:V_REG_AP2112: AP2112 - 600mA CMOS LDO Regulator w/ Enable The AP2112 is CMOS process low dropout linear regulator with enable function, the regulator delivers a guaranteed 600mA (min.) continuous load current. Features Output Voltage Accuracy: ±1.5% Output Current: 600mA (Min.) Foldback Short Current Protection: 50mA Enable Function to Turn ON/OFF VOUT Low Dropout Voltage (3.3V): 250mV (Typ.) @IOUT=600mA Excellent Load Regulation: 0.2%/A (Typ.) Excellent Line Regulation: 0.02%/V (Typ.) Low Quiescent Current: 55μA (Typ.) Low Standby Current: 0.01μA (Typ.) Low Output Noise: 50μVRMS PSRR: 100Hz -65dB, 1kHz -65dB OTSD Protection Stable with 1.0μF Flexible Cap: Ceramic, Tantalum and Aluminum Electrolytic Operation Temperature Range: -40°C to 85°C ESD: MM 400V, HBM 4000V; PROD_ID: VREG-12457
U6 = SparkFun-IC-Comms:CH340E; PROD_ID: IC-14135
Y2 = SparkFun-Clocks:CRYSTAL-32.768KHZ: 32.768kHz Crystal Frequency: 32.768kHz Frequency Stability: ±20ppm Load Capacitance: 12.5pF (PTH-2X6 & SMD-3.2X1.5), 6pF (SMD-2X6) SparkFun Products: SparkFun BigTime Watch Kit <https://www.sparkfun.com/products/11734> SparkFun nRF52832 Breakout <https://www.sparkfun.com/products/13990> SparkFun Real Time Clock Module <https://www.sparkfun.com/products/12708>; PROD_ID: XTAL-13062

## Net classes
0 default: width 0 mm, drill 0 mm
1 power: width 0.762 mm
2 usb: width 0.254 mm, drill 0.305 mm, clearance 0.254 mm

## Board
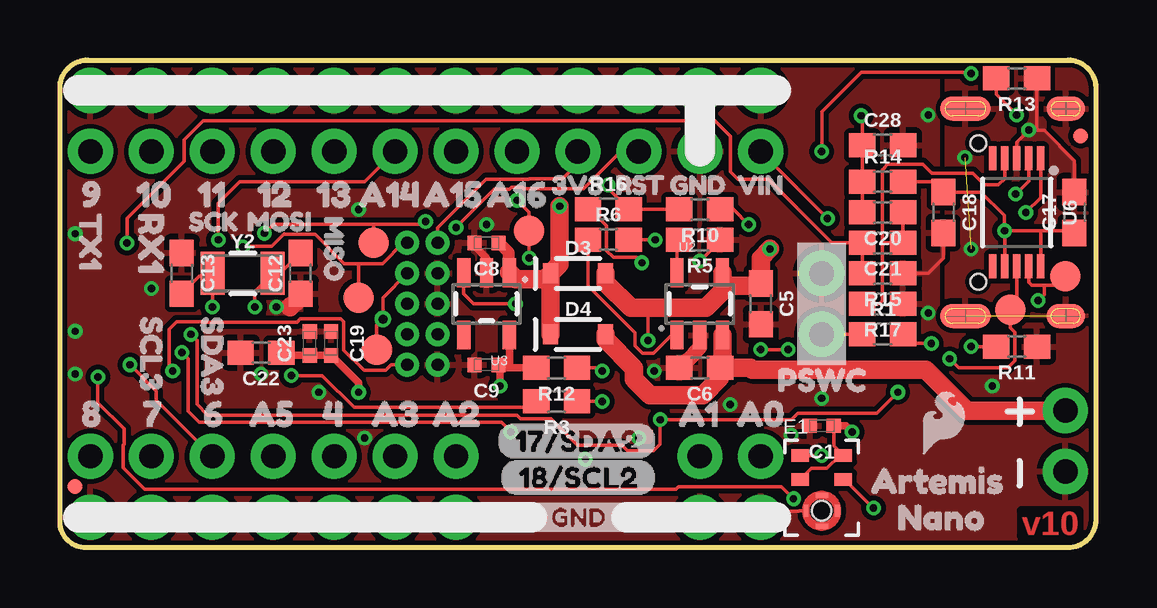
[diagram p2: board, top side]
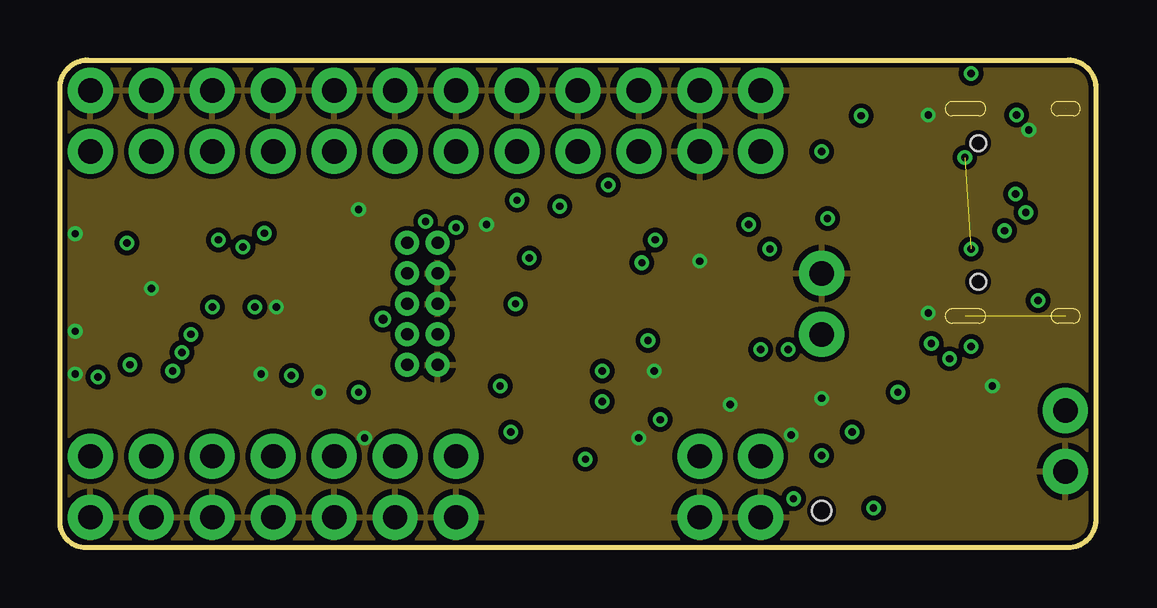
[diagram p3: board, inner layer Route2]
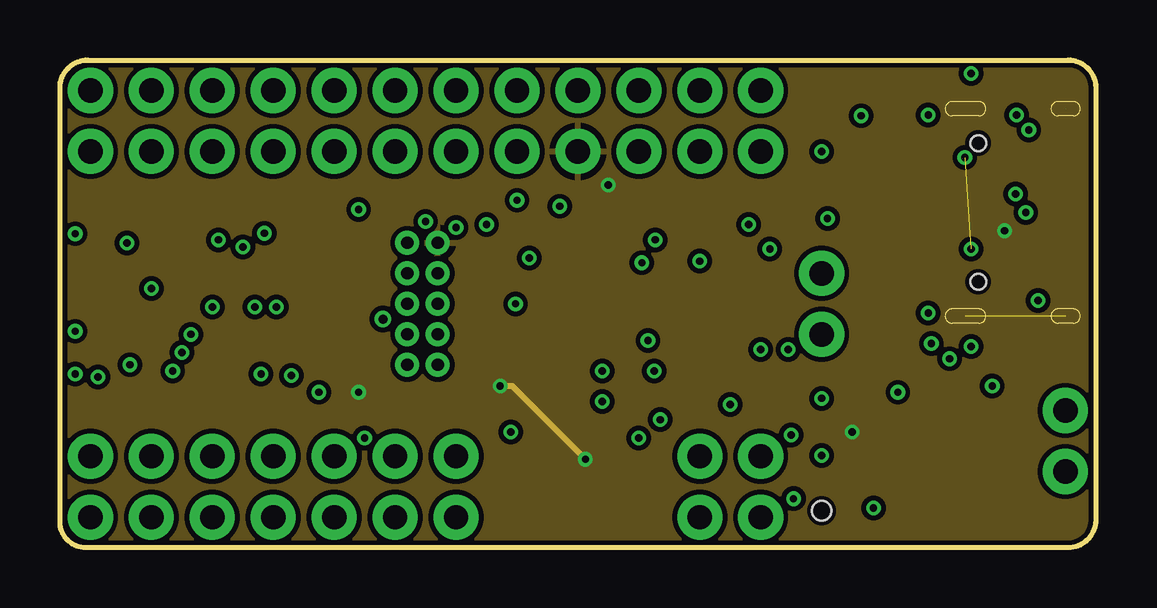
[diagram p4: board, inner layer Route15]
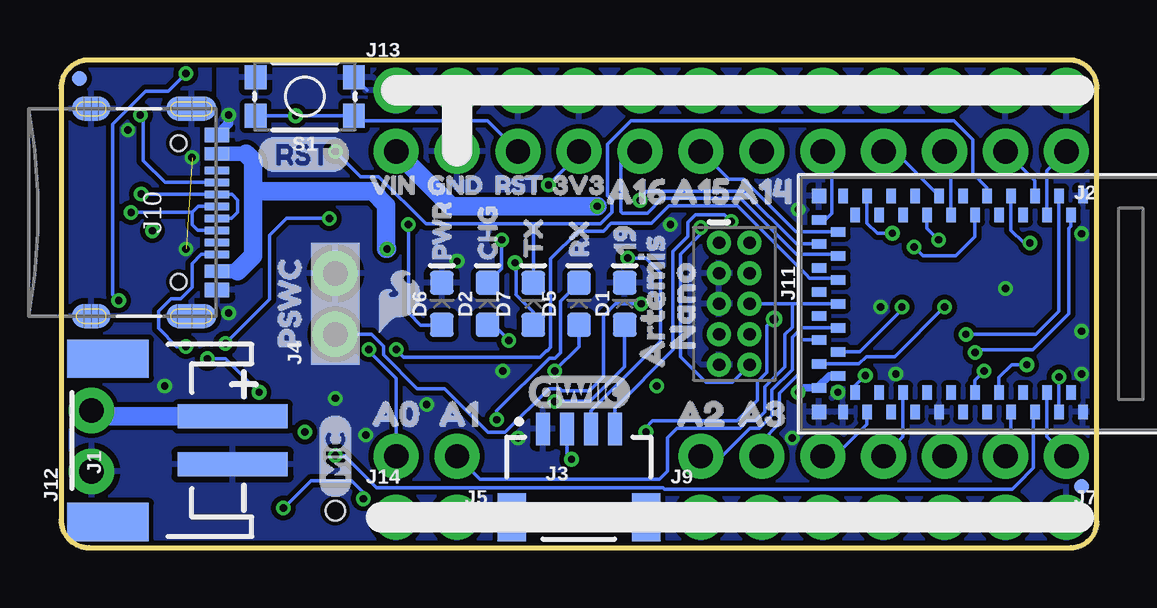
[diagram p5: board, bottom side, seen from below]

Size 43.18 x 20.32 mm. Coordinates in mm from the lower left corner, seen from the top.
Outline: 1.07,0 arc-90 0,1.07 0,19.16 arc-90 1.16,20.32 42.02,20.32 arc-90 43.18,19.16 43.18,1.16 arc-90 42.02,0 1.07,0
Copper layers (1*2*15*16): Top 0.035559375mm / dielectric 0.47751875mm / Route2 0.035559375mm / dielectric 0.47751875mm / Route15 0.035559375mm / dielectric 0.47751875mm / Bottom 0.035559375mm
Design rules "SparkFun-4-layer-TIGHT *": minimum track width 6mil, minimum drill 12mil, track to track 6mil, track to pad 6mil, pad to pad 6mil, via to via 6mil, smd to smd 6mil, copper to edge 6mil, drill to drill 6mil, minimum pad ring 6mil, minimum via ring 6mil, stop-mask expansion 4mil, vias tented up to drill 25mil, thermal gap 10mil

### Footprints (pad centres in the part's own frame; a part is rotated, then mirrored left to right if it is on the bottom)
0402-TIGHT = smd 0.6 x 0.6: 1 -0.5,0; 2 0.5,0
0603 = smd 1.1 x 1: 1 -0.85,0; 2 0.85,0
LED-0603 = smd 1 x 1: A -0.877,0; C 0.877,0
SOD-323 = smd 0.63 x 0.83: A 1.15,0; C -1.15,0
SPH0641LM4H-1_MICROPHONE = smd 0.725 x 0.522: 1 -0.9,1.3; 2 -0.9,0.3; 4 0.9,0.3; 5 0.9,1.3 | smd 0.5 x 0.2: 3 0,-1.65; 8 0,-0.35 | smd 0.2 x 0.5: 6 -0.65,-1; 7 0.65,-1 | hole 0.8: 0,-1
FIDUCIAL-MICRO = smd 0.635 x 0.635: 1 0,0
JST-2-SMD = smd 1 x 4.6: 1 -1,-3.7; 2 1,-3.7 | smd 1.6 x 3.4: NC1 -3.4,1.5; NC2 3.4,1.5
1X12_NO_SILK = drill 1.016 pad 1.88: 1 0,0; 2 2.54,0; 3 5.08,0; 4 7.62,0; 5 10.16,0; 6 12.7,0; 7 15.24,0; 8 17.78,0; 9 20.32,0; 10 22.86,0; 11 25.4,0; 12 27.94,0
JST04_1MM_RA = smd 0.6 x 1.35: 1 -1.5,0; 2 -0.5,0; 3 0.5,0; 4 1.5,0 | smd 1.2 x 2: NC1 2.8,-3.675; NC2 -2.8,-3.675
1X02_NO_SILK = drill 1.016 pad 1.88: 1 0,0; 2 2.54,0
1X07_NO_SILK = drill 1.016 pad 1.88: 1 0,0; 2 2.54,0; 3 5.08,0; 4 7.62,0; 5 10.16,0; 6 12.7,0; 7 15.24,0
USB-C-16P-4LAYER-ISOLATED = smd 0.3 x 1.016: A5 -1.25,0.154; A6 -0.25,0.154; A7 0.25,0.154; A8 1.25,0.154; B5 1.75,0.154; B6 0.75,0.154; B7 -0.75,0.154; B8 -1.75,0.154 | smd 0.6 x 1.016: GND -3.225,0.154; GND2 3.225,0.154 | smd 1 x 2.1: SHLD1 -4.32,-0.915; SHLD2 4.32,-0.915 | smd 1 x 2.1 bottom: SHLD3 -4.32,-0.915; SHLD4 4.32,-0.915 | smd 1 x 1.6: SHLD5 -4.32,-5.095; SHLD8 4.32,-5.095 | smd 1 x 1.6 bottom: SHLD6 -4.32,-5.095; SHLD7 4.32,-5.095 | smd 0.55 x 1.016: VBUS1 -2.45,0.154; VBUS2 2.45,0.154 | hole 0.65: -2.89,-1.445; 2.89,-1.445
2X5-PTH-1.27MM-NO_SILK = drill 0.508 pad 1: 1 -2.54,-0.635; 2 -2.54,0.635; 3 -1.27,-0.635; 4 -1.27,0.635; 5 0,-0.635; 6 0,0.635; 7 1.27,-0.635; 8 1.27,0.635; 9 2.54,-0.635; 10 2.54,0.635
TACTILE_SWITCH_SMD_4.6X2.8MM = smd 0.9 x 1: 1 -2.05,-0.8; 2 2.05,-0.8; 3 2.05,0.8; 4 -2.05,0.8
PAD.03X.05 = smd 1.27 x 1.27: P$1 0,0
ARTEMIS_FP = smd 0.4 x 0.6: AD16 -4,-3.7; BOOT 1.5,4.5; D0 0.5,-4.5; D1 -0.5,-4.5; D2 -1,-3.7; D3 2,-3.7; D7 -1.5,4.5; D8 -0.5,4.5; D9 2,3.7; D10 1,3.7; D14 -5,3.7; D17 -3.5,-4.5; D36 2.5,-4.5; D38 3,-3.7; D40 2.5,4.5; D41 -2.5,-4.5; GND@1 4.5,4.5; GND@39 -5.5,-4.5; GND@47 -1.5,-4.5; GND@59 4.5,-4.5; RXI-0 3.5,4.5; SWDCK 4,3.7; SWDIO 0,3.7; TXO-0 0.5,4.5; ~AD31 -3,-3.7; ~AD35 -2,3.7; ~D4 -2.5,4.5; ~D5 -1,3.7; ~D18 -4.5,-4.5; ~D19 -5,-3.7; ~D22 -3.5,4.5; ~D23 -4,3.7; ~D24 -3,3.7; ~D27 -4.5,4.5; ~D28 -5.5,4.5; ~D37 3.5,-4.5; ~D39 3,3.7; ~D42 1.5,-4.5; ~D43 1,-3.7; ~D44 4,-3.7; ~D45 -2,-3.7; ~RST 0,-3.7 | smd 0.6 x 0.4: AD34 -6.5,-0.5; D15 -6.5,0.5; VDD@36 -5.7,-3; VDD@37 -6.5,-3.5; XI -6.5,-2.5; XO -5.7,-2; ~AD11 -5.7,-1; ~AD12 -5.7,2; ~AD13 -5.7,1; ~AD29 -6.5,-1.5; ~AD32 -5.7,3; ~AD33/SWO -5.7,0; ~D6 -6.5,3.5; ~D25 -6.5,2.5; ~D26 -6.5,1.5 | smd 0.6 x 0.6: GND@22 -6.5,4.5; GND@38 -6.5,-4.5
SOT23-5 = smd 0.55 x 1.2: 1 -0.95,-1.3; 2 0,-1.3; 3 0.95,-1.3; 4 0.95,1.3; 5 -0.95,1.3
MSOP10 = smd 1 x 0.3: 1 -2.25,1; 2 -2.25,0.5; 3 -2.25,0; 4 -2.25,-0.5; 5 -2.25,-1; 6 2.25,-1; 7 2.25,-0.5; 8 2.25,0; 9 2.25,0.5; 10 2.25,1
CRYSTAL-SMD-3.2X1.5MM = smd 1 x 1.8: P$1 -1.25,0; P$2 1.25,0

### Placement (x,y rotation side)
C1  31.75,5.08 180 top
C5  29.21,10.16 270 top
C6  26.67,7.49 180 top
C8  17.78,12.7 180 top
C9  17.78,7.62 180 top
C12  10.03,11.43 90 top
C13  5.08,11.43 270 top
C17  42.29,13.97 90 top
C18  36.83,13.97 270 top
C19  11.3,8.51 270 top
C20  34.29,13.97 180 top
C21  34.29,12.7 180 top
C22  8.38,8.13 180 top
C23  10.41,8.51 90 top
C28  34.29,16.76 0 top
D1  19.68,10.16 90 bottom
D2  25.4,10.16 90 bottom
D3  21.59,11.43 0 top
D4  21.59,8.89 0 top
D5  21.59,10.16 90 bottom
D6  27.3,10.16 90 bottom
D7  23.5,10.16 90 bottom
E1  31.75,2.54 0 top
FD1  0.64,2.54 0 bottom
FD2  42.42,19.56 0 bottom
FD3  42.55,17.14 0 top
FD4  0.64,2.54 0 top
FRAME1  40.64,-21.59 0 bottom  (outside the outline)
FRAME2  43.18,0 0 top
J1  39.73,4.47 90 bottom
J2  1.27,16.51 180 bottom
J3  21.59,4.95 0 bottom
J4  31.75,8.89 90 bottom
J5  26.67,3.81 180 bottom
J7  1.27,3.81 180 bottom
J9  16.51,1.27 0 bottom
J10  36.83,13.97 270 bottom
J11  15.11,10.16 270 bottom
J12  41.91,3.17 90 bottom
J13  29.21,19.05 0 bottom
J14  29.21,1.27 0 bottom
LOGO1  29.08,10.29 0 bottom
LOGO2  39.37,1.27 0 top
LOGO4  36.83,5.21 0 top
R1  34.29,8.89 0 top
R3  20.7,6.1 180 top
R5  26.67,12.83 180 top
R6  22.86,12.83 0 top
R10  26.67,14.1 180 top
R11  39.88,8.38 180 top
R12  20.7,7.49 180 top
R13  39.88,19.56 180 top
R14  34.29,15.24 0 top
R15  34.29,11.43 180 top
R16  22.86,14.1 0 top
R17  34.29,10.16 180 top
S1  33.02,18.8 180 bottom
TP1  13.21,8.26 0 top
TP2  12.45,10.41 0 top
TP3  19.56,13.21 0 top
TP4  13.08,12.7 0 top
TP5  39.62,9.91 0 top
TP6  41.91,11.3 0 top
U1  5.08,10.16 0 bottom
U2  26.67,10.16 0 top
U3  17.78,10.16 180 top
U6  39.88,13.97 270 top
U$1  [3V316]  23.37,15.11 0 bottom
U$2  [____GND____2]  18.67,1.27 0 top
U$3  [RST19]  25.78,15.11 0 bottom
U$4  [PSWC4]  33.66,7.49 90 bottom
U$5  [CHG26]  25.4,11.3 90 bottom
U$6  [PWR27]  27.3,11.3 90 bottom
U$7  [GND17]  28.57,15.11 0 bottom
U$8  [QWIIC#LOGO#JPG]  21.59,6.5 0 bottom
U$9  [A00]  31.11,5.59 0 bottom
U$10  [A57]  6.99,5.59 0 top
U$11  [SCL30]  3.81,10.41 270 top
U$12  [A145]  11.56,14.73 0 top
U$13  [ARTEMIS6]  32.89,2.79 0 top
U$14  [MISO5]  11.43,14.48 270 top
U$15  [MIC0]  31.75,2.03 90 bottom
U$16  [MOSI4]  7.11,13.59 0 top
U$17  [NANO7]  34.04,1.27 0 top
U$18  [SCK3]  4.7,13.59 0 top
U$19  [A32]  12.06,5.59 0 top
U$20  [A00]  27.3,5.59 0 top
U$21  [A21]  14.61,5.59 0 top
U$22  [ARTEMIS6]  18.54,6.6 90 bottom
U$23  [PSWC4]  29.08,6.99 0 top
U$24  [NANO7]  17.27,7.37 90 bottom
U$25  [PRODUCTION_INSTRUCTIONS]  -6.35,50.8 0 bottom  (outside the outline)
U$26  [191]  19.68,11.43 90 bottom
U$27  [VIN19]  30.99,15.11 0 bottom
U$28  [A156]  14.22,14.73 0 top
U$30  [GND2]  19.81,1.27 0 top
U$31  [SDA31]  6.35,10.41 270 top
U$32  [46]  10.03,5.59 0 top
U$33  [GND17]  24.77,15.11 0 top
U$34  [A10]  24.89,5.59 0 top
U$35  [68]  5.08,5.59 0 top
U$36  [79]  2.54,5.59 0 top
U$37  [810]  0,5.59 0 top
U$38  [RST19]  22.48,15.11 0 top
U$39  [VIN19]  27.56,15.11 0 top
U$40  [A10]  28.32,5.59 0 bottom
U$41  [A21]  18.41,5.59 0 bottom
U$42  [A32]  15.88,5.59 0 bottom
U$45  [90]  0,14.73 0 top
U$46  [101]  2.29,14.73 0 top
U$47  [112]  4.83,14.73 0 top
U$48  [A167]  16.89,14.73 0 top
U$49  [3V316]  19.81,15.11 0 top
U$50  [RX10]  3.81,14.86 270 top
U$51  [RST1]  35.05,16.38 0 bottom
U$52  [123]  7.11,14.73 0 top
U$53  [134]  9.78,14.73 0 top
U$54  [A145]  16.13,14.86 0 bottom
U$55  [A156]  18.67,14.86 0 bottom
U$56  [A167]  21.34,14.86 0 bottom
U$57  [17#SDA21]  18.16,4.45 0 top
U$59  [TX12]  1.27,14.86 270 top
U$60  [18#SCL20]  18.29,2.92 0 top
U$85  [RX23]  21.59,11.43 90 bottom
U$86  [TX22]  23.5,11.43 90 bottom
Y2  7.62,11.43 0 top

### Tracks (layer width: path | path; a pad name or v marks a point on that pad's centre or on a via)
3.3V  (via drill 0.3)
  Top 0.152: R14.2 36.41,15.24 C18.1 38.39,14.82 39.37,13.84 v39.37,13.21 v39.38,13.2 | R10.2 R16.2 22.86,14.95 v22.86,15.11 | C1.1 32.25,4.24 E1.5 32.5,3.84 31.97,3.31 31.32,3.31 E1.2 | U3.5 18.73,9.34 | J11.1 15.75,13.33 17.76,15.34 19.53,15.34 19.56,15.37 20.95,15.37 21.59,16 J2.9 | v39.38,13.2 U6.7 | C17.1 42.2,13.21 40.89,13.21 | 40.89,13.21 39.39,13.21 v39.38,13.2 | 40.89,13.21 40.88,13.19 U6.10
  Top 0.305: v12.45,6.48 12.45,6.87 C19.2 C23.1 9.35,8.01 C22.1 | v18.35,6.73 18.35,7.55 18.41,7.62 C9.1 18.41,7.49 18.67,7.49 | R12.2 18.67,7.49 | U3.5 18.73,7.55 18.67,7.49 | v33.02,4.83 v33.01,4.83 32.76,5.08 C1.1
  Route15 0.254: v21.9,3.68 18.86,6.73 v18.35,6.73
  Bottom 0.152: J2.9 21.59,16.38 v22.86,15.11 | J3.2 22.09,3.87 v21.9,3.68
  Bottom 0.305: U1.VDD@36 11.16,7.16 11.58,6.74 U1.VDD@37 12.26,6.66 v12.45,6.48
  pour Route15 (isolate 0.203): 43.18,20.32 0,20.32 0,0 43.18,0
8
  Bottom 0.152: U1.D38 2.08,4.62 J7.1
10
  Bottom 0.152: U1.D40 2.58,15.28 J2.2
!RESET  (via drill 0.3)
  Top 0.152: v33.4,18 33.44,17.96 C28.1 R14.1 C20.2 | J2.10 24.03,16.41 23.27,16.41 21.82,14.95 19.33,14.95 19.27,15.01 18.83,15.01 18.75,14.93 18.1,14.93 v16.51,13.34 | v4.7,7.37 4.55,7.52 4.55,9.11 4.86,9.42 5.94,9.42 5.96,9.4 9.88,9.4 10.02,9.54 11.7,9.54 11.83,9.4 11.83,8.23 12.68,7.39 13.57,7.39 13.79,7.62 J11.10
  Bottom 0.152: S1.3 v33.4,18 S1.4 30.75,17.78 25.4,17.78 J2.10 | v4.7,7.37 5.08,6.99 U1.~RST | J11.10 14.48,7.61 15.19,6.89 16.3,6.89 17.37,7.95 17.37,12.22 16.51,13.08 v16.51,13.34
!RTS
  Top 0.152: 34.29,12.7 34.29,15.75 34.36,15.82 34.36,15.84 34.49,15.97 35.97,15.97 36.34,15.6 38.05,15.6 38.53,15.11 39.12,15.11 39.38,15.38 U6.4 | C20.1 C21.1 34.29,12.7 | R17.2 34.16,10.16 34.29,10.29 34.29,12.7
BOOT  (via drill 0.3)
  Top 0.152: R15.2 C21.2 32.18,12.7 29.54,15.34 28.27,15.34 27.94,15.67 27.94,17.14 27.3,17.78 5.97,17.78 5.87,17.68 5.18,16.99 5.18,16.1 2.79,13.72 v2.79,12.7
  Bottom 0.152: U1.BOOT 3.58,13.23 3.05,12.7 v2.79,12.7
CC1  (via drill 0.3)
  Top 0.152: v39.88,18.03 39.03,18.88 R13.2
  Bottom 0.152: J10.A5 38.84,15.22 39.75,16.13 39.75,17.91 v39.88,18.03
CC2  (via drill 0.3)
  Top 0.152: R11.2 v37.97,8.38
  Bottom 0.152: J10.B5 37.34,12.22 37.72,11.84 37.72,10.85 38.19,10.38 38.6,10.38 39.12,9.86 39.12,9.14 38.35,8.38 v37.97,8.38
D+1  (via drill 0.3)
  Top 0.152: U6.1 40.88,14.59 v40.26,13.97
  Bottom 0.152: J10.A6 37.47,14.22 37.72,13.97 | 37.72,13.97 37.72,13.46 37.48,13.22 J10.B6 | 37.72,13.97 v40.26,13.97
D-1  (via drill 0.3)
  Top 0.152: U6.2 40.38,15.27 v39.84,14.73
  Bottom 0.152: v39.84,14.73 39.83,14.72 J10.B7 36.06,14.72 35.81,14.48 35.81,13.97 36.07,13.72 J10.A7
GND  (via drill 0.3)
  Top 0.152: E1.6 31.12,1.56 31.12,1.8 31.49,2.17 31.73,2.17 E1.8 31.77,2.17 32.01,2.17 32.38,1.8 32.38,1.56 E1.7 32.38,1.52 32.38,1.28 32.01,0.91 31.77,0.91 E1.3 31.73,0.91 31.49,0.91 31.12,1.28 31.12,1.52 E1.6 | J14.1 29.48,1.54 30.32,1.54 30.36,1.51 30.8,1.51 30.83,1.54 E1.6 | R15.1 36.2,11.43 36.83,12.06 C18.2 | R5.1 27.52,12.79 v26.67,11.94 | U6.3 39.88,16.89 v40.39,17.4 | R13.1 40.73,17.4 v40.39,17.4 | C17.2 42.29,16.13 41.02,17.4 v40.39,17.4
  Top 0.254: 9.58,10.03 v9.02,10.03
  Top 0.305: U3.2 17.79,11.47 17.79,12.06 17.28,12.57 C8.2
  Top 0.61: U2.2 26.67,8.34 26.45,8.12 26.45,8.07 26.18,7.8 26.13,7.8 C6.2
  Top 0.762: C12.1 9.9,10.45 9.9,10.31 9.6,10.01 9.58,10.03
  Bottom 0.152: S1.1 30.42,19.05
  Bottom 0.406: J10.GND 36.2,17.68 v36.2,18.03
  other vias: 10.79,6.48 8.38,7.24 0.64,7.24 0.64,9.02 0.64,13.08 3.81,10.79 30.48,4.7 27.94,5.97 31.75,6.22 38.86,6.73 24.77,7.37 24.13,4.57 12.45,14.1 12.7,4.57 36.2,9.78 17.78,13.46
  pour Bottom (isolate 0.203, rank 6): 43.18,0 0,0 0,20.32 43.18,20.32
  pour Top (isolate 0.203, rank 6): 43.18,0 0,0 0,20.32 43.18,20.32
  pour Route2 (isolate 0.203): 43.18,20.32 0,20.32 0,0 43.18,0
N$1
  Top 0.152: U2.5 25.72,12.73 R5.2
N$2  (via drill 0.3)
  Top 0.152: v8.13,10.03 8.11,10.05 8.11,10.67 Y2.P$2 9.18,11.43 C12.2
  Bottom 0.152: U1.XO 9.87,8.16 8.13,9.91 v8.13,10.03
N$3  (via drill 0.3)
  Top 0.152: v24.81,12.83 R6.2
  Bottom 0.152: D2.C 24.81,11.62 v24.81,12.83
N$4
  Top 0.152: U2.1 25.49,8.86 24.73,8.1 24.29,8.1 23.98,8.41 23.98,8.95 22.01,10.92 R6.1
N$5  (via drill 0.3)
  Top 0.152: v24.26,11.87 24.03,12.1 23.07,12.1 22.79,12.38 22.79,13.42 22.11,14.1 R16.1
  Bottom 0.152: D7.A 23.5,9.8 24.22,10.53 24.22,11.84 v24.26,11.87
N$7  (via drill 0.3)
  Top 0.152: R3.1 v22.61,6.1
  Bottom 0.152: v22.61,6.1 21.13,6.1 19.68,7.54 D1.A
N$8  (via drill 0.3)
  Top 0.152: v6.35,10.03 6.37,10.05 6.37,11.3 | 6.37,11.3 Y2.P$1 | C13.2 5.8,11.3 6.37,11.3
  Bottom 0.152: U1.XI 9.92,7.66 9.62,7.96 8.43,7.96 v6.35,10.03
N$9  (via drill 0.3)
  Top 0.152: R12.1 22.48,7.49 v22.61,7.37
  Bottom 0.152: v22.61,7.37 21.59,8.38 D5.A
N$10  (via drill 0.3)
  Top 0.152: R10.1 28.07,14.1 v28.7,13.46
  Bottom 0.152: v28.7,13.46 28.7,9.78 28.19,9.27 27.32,9.27 D6.A
PDMCLK  (via drill 0.3)
  Top 0.152: v1.58,7.11 1.58,6.04 2.67,4.95 2.67,4.32 2.64,4.29 2.64,3.33 3.33,2.64 3.53,2.44 25.68,2.44 25.78,2.54 30.08,2.54 v30.58,2.04 | v33.91,1.65 32.72,2.84 E1.4
  Bottom 0.152: U1.~D37 v1.58,7.11 | v30.58,2.04 30.58,2.29 31.07,2.79 32.77,2.79 v33.91,1.65
PDMDATA  (via drill 0.3)
  Top 0.152: E1.1 v31.75,3.84
  Bottom 0.152: U1.D36 2.64,5.6 2.64,3.33 3.33,2.64 3.53,2.44 18.03,2.44 18.09,2.51 30.04,2.51 31.37,3.84 v31.75,3.84
RXI-0  (via drill 0.3)
  Top 0.152: U6.8 39.88,10.16 TP5.P$1 39.62,9.16 39.81,8.98 39.81,7.79 39.51,7.49 37.47,7.49 v37.08,7.87 | v5.46,8.89 5.71,8.64 5.71,5.97 6.16,5.52 19.05,5.52 19.21,5.37 20.48,5.37 21.57,4.27 23.43,4.27 23.66,4.04 24.74,4.04 25.02,4.32 v25.02,5.33 30.48,5.33 30.75,5.61 34.06,5.61 v34.92,6.48
  Bottom 0.152: v37.08,7.87 36.32,7.87 v34.92,6.48 | D5.C 22.35,10.28 22.35,8.13 22.58,7.9 22.83,7.9 25.02,5.71 v25.02,5.33 | U1.RXI-0 1.58,9.85 2.54,8.89 v5.46,8.89
SHLD  (via drill 0.3)  (5 unrouted)
  other vias: 37.72,16.26 37.97,12.45
  pour Bottom (isolate 0.203): 43.18,9.65 36.96,9.65 36.96,20.32 43.18,20.32
  pour Top (isolate 0.203): 43.18,9.65 36.96,9.65 36.96,20.32 43.18,20.32
SWDCK  (via drill 0.3, 0.38)
  Top 0.152: v5.08,8.13 5.33,7.87 5.33,5.69 5.8,5.22 18.4,5.22 v18.8,4.83 | J11.4 13.46,10.41 v13.46,9.53 13.21,9.27 TP1.P$1
  Bottom 0.152: v18.8,4.83 18.8,5 18.52,5.28 15.01,5.28 14.15,6.15 14.15,6.92 13.75,7.32 13.75,9.24 v13.46,9.53 | v5.08,8.13 4.95,8.26 2.67,8.26 1.17,9.75 1.17,13.3 1.08,13.39 U1.SWDCK
SWDIO  (via drill 0.3)
  Top 0.152: v7.62,12.52 7.67,12.57 8.82,12.57 9.33,13.08 9.36,13.06 10.63,13.06 11.85,11.84 12.45,11.84 | J11.2 14.3,12.7 13.44,11.84 12.45,11.84 | TP2.P$1 12.45,11.84
  Bottom 0.152: v7.62,12.52 7.26,12.17 5.88,12.17 5.08,12.96 U1.SWDIO
TXO-0  (via drill 0.3)
  Top 0.152: TP6.P$1 41.87,11.3 41.5,10.94 41.02,10.94 | 41.02,10.94 40.51,10.94 40.38,11.07 U6.9 | v40.78,10.3 41.02,10.54 41.02,10.94 | v31.75,16.51 31.75,18.16 33.4,19.81 37.92,19.81 v37.97,19.76
  Bottom 0.152: U1.TXO-0 4.58,14.99 5.18,15.6 5.18,16.99 5.97,17.78 19.43,17.78 20.22,16.99 20.4,16.81 20.4,14.65 20.22,14.48 20.22,13.97 20.7,13.49 23.5,13.49 | 23.5,13.49 D7.C | v40.78,10.3 41.02,10.54 41.02,17.65 40.64,18.03 40.63,18.03 39.65,19.02 38.72,19.02 v37.97,19.76 | v31.75,16.51 30.69,15.45 29.94,15.45 27.97,13.49 23.5,13.49
V_BATT
  Top 0.762: J12.2 37.8,5.71 36.09,7.42 28.86,7.42 28.79,7.49 C6.1 | U2.3 27.62,7.59 C6.1 | D4.A 22.73,8.68 23.93,7.49 23.93,7.02 24.6,6.35 26.8,6.35 27.52,7.07 C6.1
  Bottom 0.762: J12.2 41.66,5.47 J1.2
V_USB  (via drill 0.3)
  Top 0.152: v24.51,8.64 24.51,9.99
  Top 0.762: v29.59,12.45 29.21,12.06 C5.1 29.12,10.92 27.62,10.92 | D3.A 22.74,11.05 23.8,9.99 24.51,9.99 26.92,9.99 27.62,10.69 27.62,10.92 | U2.4 27.62,10.92
  Bottom 0.152: D2.A 25.16,9.28 v24.51,8.64
  Bottom 0.61: J10.VBUS1 35.47,16.42 | 35.81,11.52 J10.VBUS2
  Bottom 0.762: 35.47,16.42 35.18,16.13 35.18,14.84 | 35.18,14.84 30.2,14.84 29.63,14.28 29.63,12.45 v29.59,12.45 | 35.18,14.84 35.18,12.15 35.81,11.52
VIN  (via drill 0.3)
  Top 0.152: v31.99,13.72 29.21,16.5 J2.12 | R1.2 35.52,8.51 v36.32,8.51
  Top 0.508: 18.71,11.47 18.71,12.28 18.3,12.7 C8.1
  Top 0.762: 18.71,11.47 U3.1 19.01,11.18 20.19,11.18 D3.C | D4.C D3.C | D3.C 20.83,11.82 v20.83,14.22
  Bottom 0.152: v31.99,13.72 33.78,13.72 34.48,13.02 34.48,10.35 v36.32,8.51
  Bottom 0.762: J2.12 26.92,14.22 v20.83,14.22
VREG_EN  (via drill 0.3)
  Top 0.152: U3.3 16.83,10.57 17.24,10.16 v18.99,10.16 | R1.1 J4.1
  Bottom 0.152: v18.99,10.16 20.07,10.16 20.57,9.65 20.57,7.11 21.14,6.54 22.3,6.54 22.39,6.63 22.84,6.63 24.67,4.8 25.38,4.8 27.2,6.63 28.34,6.63 29.74,8.03 29.74,8.4 30.23,8.89 J4.1
~4
  Bottom 0.152: U1.~D18 9.58,5.15 10.92,3.81 J7.5
~6  (via drill 0.3)
  Top 0.152: v2.92,7.62 4.01,6.53 4.01,6.15 J7.3
  Bottom 0.152: U1.~D43 4.08,7.1 3.56,7.62 v2.92,7.62
~7
  Bottom 0.152: U1.~D42 3.58,3.81 J7.2
~9
  Bottom 0.152: U1.~D39 2.08,15.7 J2.1
~11
  Bottom 0.152: U1.~D5 6.08,16.24 J2.3
~12
  Bottom 0.152: U1.D7 8.43,16.51 J2.4
~13
  Bottom 0.152: J2.5 11.05,16.13 11.05,13.94 11.33,13.66 U1.~D6
~A0  (via drill 0.3)
  Top 0.152: v30.35,8.26 v29.21,8.26
  Bottom 0.152: U1.~AD13 10.85,11.23 11.97,11.23 12.11,11.37 14.98,14.25 17.84,14.25 18.58,13.51 20.25,13.51 20.58,13.18 21.61,13.18 22.77,12.03 22.77,8.35 22.91,8.2 22.95,8.2 23.22,7.94 28.89,7.94 v29.21,8.26 | v30.35,8.26 30.35,8.21 29.21,7.07 J5.2
~A1
  Bottom 0.152: U1.~AD33/SWO 12.7,10.16 | 12.7,10.16 J11.6 | J5.1 25.7,2.85 18.24,2.85 17.91,3.17 17.91,4.57 17.5,4.98 14.88,4.98 14.58,5.28 14.22,5.28 13.84,5.67 13.84,6.7 13.01,7.54 13.01,8.89 12.7,9.19 12.7,10.16
~A2
  Bottom 0.152: J7.7 15.62,3.81 14.45,4.98 14.07,4.98 13.54,5.51 13.54,6.57 12.7,7.41 12.7,8.76 12.3,9.16 U1.~AD11
~A3
  Bottom 0.152: U1.~AD29 12.29,8.66 12.38,8.57 12.38,7.29 13.23,6.44 13.23,5.18 13.97,4.45 J7.6
~A5
  Bottom 0.152: U1.~AD31 8.08,4.62 J7.4
~A14  (via drill 0.3)
  Top 0.152: v6.6,12.83 6.6,14.35 7.49,15.24 12.7,15.24 J2.6
  Bottom 0.152: U1.~AD35 7.08,13.3 v6.6,12.83
~A15
  Bottom 0.152: U1.~AD32 12.55,13.16 14.73,15.34 15.34,15.34 J2.7
~A16
  Bottom 0.152: U1.~AD12 10.85,12.23 12.54,12.23 14.86,14.55 18.13,14.55 18.74,13.95 19.78,13.95 19.84,14 19.84,16.1 19.43,16.51 J2.8
~D19/LED  (via drill 0.3)
  Top 0.152: R3.2 19.6,5.84 12.25,5.84 10.92,7.17 v9.65,7.17
  Bottom 0.152: U1.~D19 10.08,6.74 v9.65,7.17
~D25/SDA2  (via drill 0.3)
  Top 0.152: v19.05,14.48 19.56,13.97 TP3.P$1 v19.56,12.06
  Bottom 0.152: U1.~D25 12.53,12.66 14.73,14.86 18.76,14.86 19.05,14.57 v19.05,14.48 | J3.3 21.09,5.71 18.19,8.6 18.19,11.46 18.8,12.06 v19.56,12.06
~D27/SCL2  (via drill 0.3)
  Top 0.152: v8.52,13.1 8.9,13.48 13.08,13.48 | v15.24,13.59 15.13,13.48 13.08,13.48 | TP4.P$1 13.08,13.48
  Bottom 0.152: U1.~D27 9.58,13.52 9.16,13.1 v8.52,13.1 | J3.4 20.09,5.82 17.67,8.24 17.67,12.35 17.04,12.98 17.04,13.56 16.73,13.87 15.52,13.87 v15.24,13.59

### Text on the board
Top: v10
tValues: DNP
Measures: Units in inches
bDocu: Four-layer board | 0.8mm Thickness | N. Seidle